# EAGLE design openSipPuff (EAGLE 9.1.3)
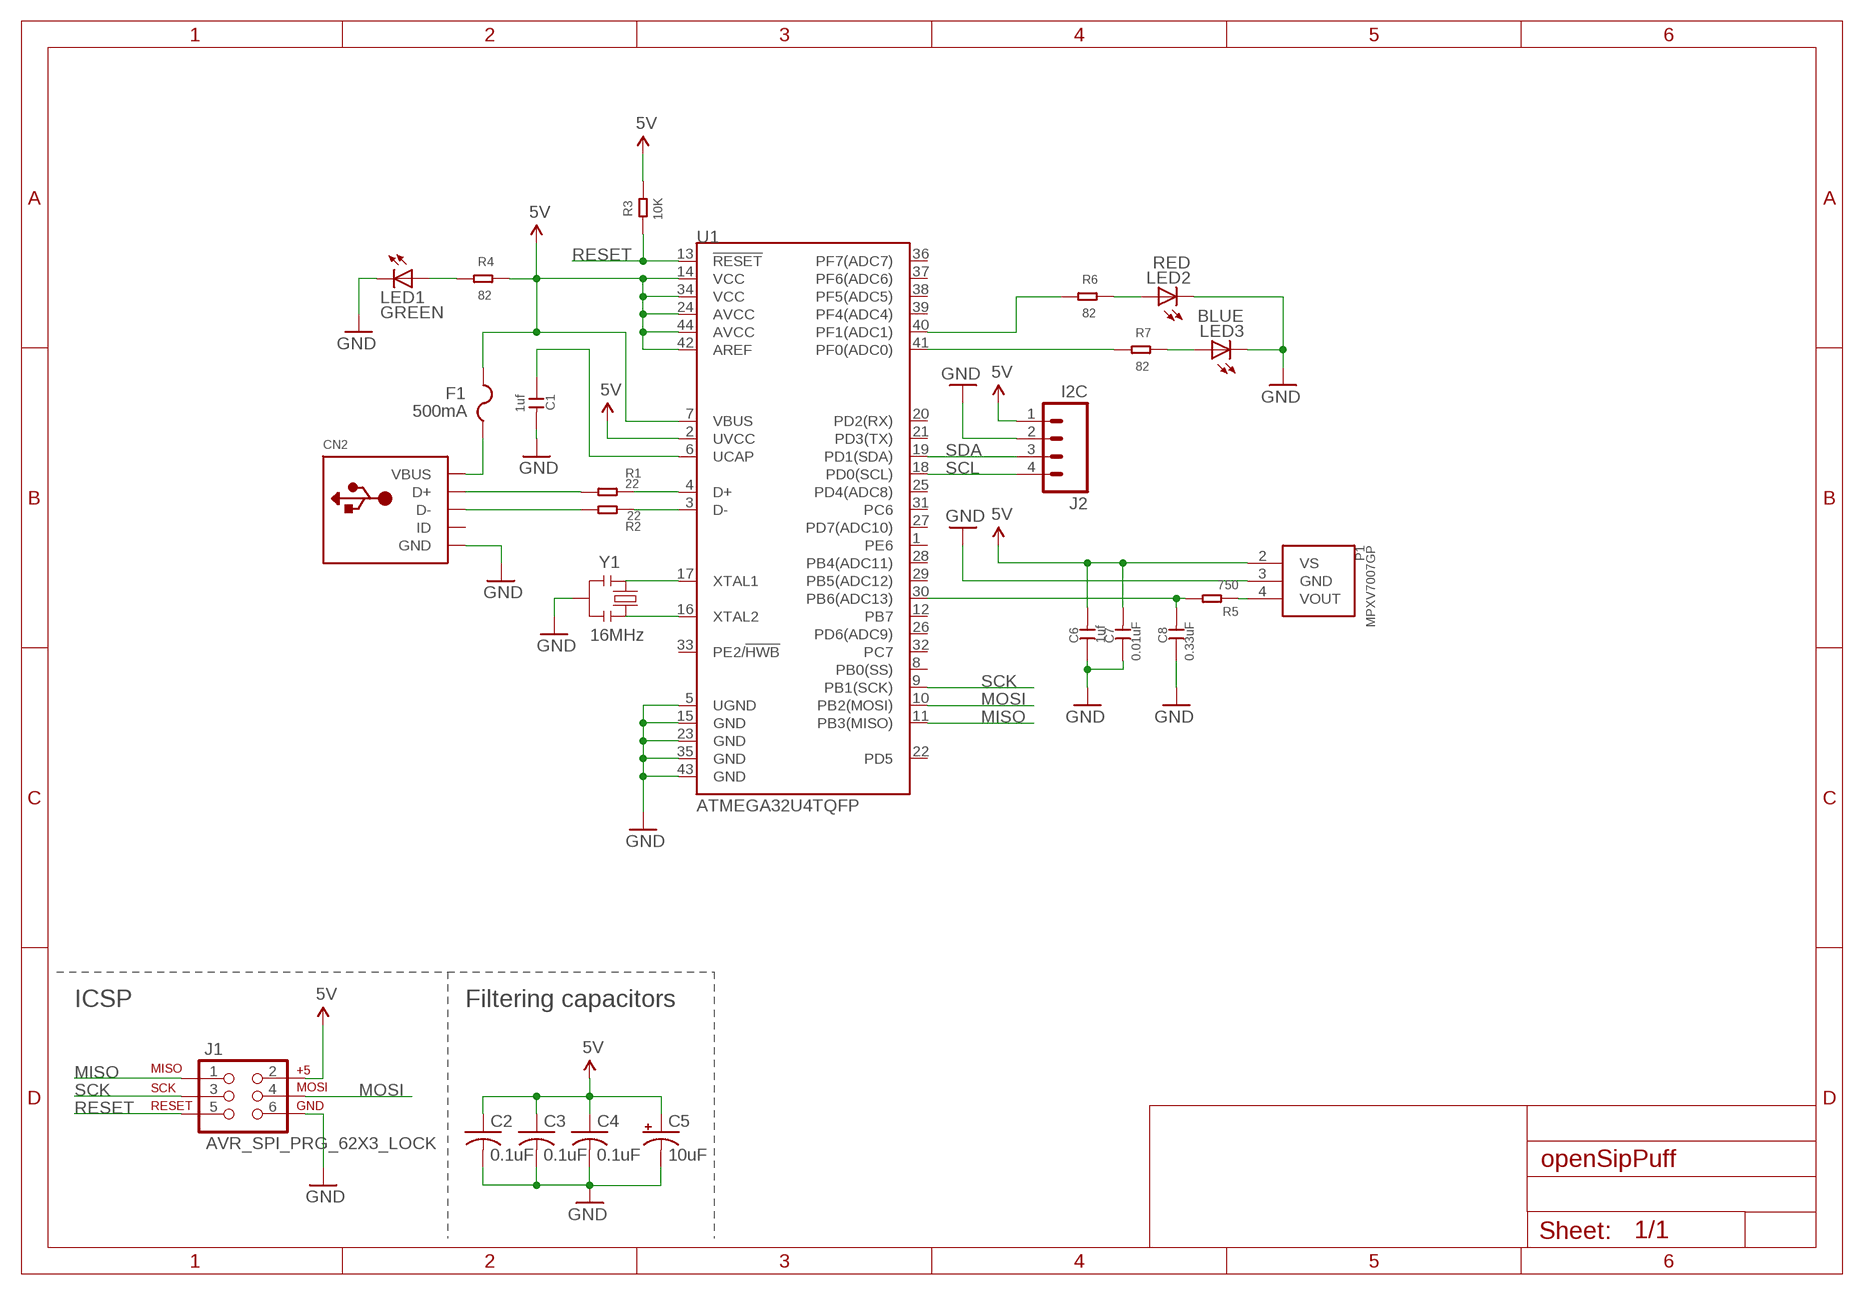
[diagram p0: schematic, sheet 1]

## Parts
C1  1uf  CERAMIC-1UF-25V-10%-X7R(0805)  [C0805]
C2  0.1uF  C-USC0805K  [C0805K]
C3  0.1uF  C-USC0805K  [C0805K]
C4  0.1uF  C-USC0805K  [C0805K]
C5  10uF  CPOL-USA/3216-18R  [A/3216-18R]
C6  1uf  CERAMIC-1UF-25V-10%-X7R(0805)  [C0805]
C7  0.01uF  CERAMIC-10NF-50V-5%-X7R(0805)  [C0805]
C8  0.33uF  CERAMIC-10NF-50V-5%-X7R(0805)  [C0805]
CN2  USBMINIB  [USB-MINIB]
F1  500mA  PTCFUSE-1206  [R1206]
J1  AVR_SPI_PRG_62X3_LOCK  [2X3_LOCK]
J2  I2C  M04PTH  [1X04]
LED1  GREEN  LEDCHIPLED_0805  [CHIPLED_0805]
LED2  RED  LEDCHIPLED_0805  [CHIPLED_0805]
LED3  BLUE  LEDCHIPLED_0805  [CHIPLED_0805]
P1  MPXV7007GP  [SOP8]
R1  22  RES-0805  [R0805]
R2  22  RES-0805  [R0805]
R3  10K  SMD-RES-10K-1%-1/8W(0805)  [R0805]
R4  82  SMD-RES-0.1R-5%-1/8W(0805)  [R0805]
R5  750  SMD-RES-2.2K-5%-1/8W(0805)  [R0805]
R6  82  SMD-RES-2.2K-5%-1/8W(0805)  [R0805]
R7  82  SMD-RES-2.2K-5%-1/8W(0805)  [R0805]
U1  ATMEGA32U4TQFP  [SPARKFUN-DIGITALIC_TQFP44]
Y1  16MHz  RESONATOR16MHZ  [RESONATOR-SMD]

## Nets
5V: C2.1 C3.1 C4.1 C5.+ C6.2 C7.2 F1.2 J1.2 J2.1 P1.2(VS) R3.2 R4.2 U1.2(UVCC) U1.7(VBUS) U1.14(VCC) U1.24(AVCC) U1.34(VCC) U1.42(AREF) U1.44(AVCC)
D+: CN2.D+ R1.1
D-: CN2.D- R2.1
GND: C1.2 C2.2 C3.2 C4.2 C5.- C6.1 C7.1 C8.1 CN2.GND J1.6 J2.2 LED1.C LED2.C LED3.C P1.3(GND) U1.5(UGND) U1.15(GND) U1.23(GND) U1.35(GND) U1.43(GND) Y1.2
MISO: J1.1 U1.11(PB3(MISO))
MOSI: J1.4 U1.10(PB2(MOSI))
N$1: R1.2 U1.4(D+)
N$2: R2.2 U1.3(D-)
N$3: C1.1 U1.6(UCAP)
N$4: CN2.VBUS F1.1
N$5: U1.17(XTAL1) Y1.1
N$6: U1.16(XTAL2) Y1.3
N$7: C8.2 R5.2 U1.30(PB6(ADC13))
N$8: R6.1 U1.40(PF1(ADC1))
N$9: R7.1 U1.41(PF0(ADC0))
N$10: P1.4(VOUT) R5.1
N$12: LED1.A R4.1
N$14: LED3.A R7.2
N$15: LED2.A R6.2
RESET: J1.5 R3.1 U1.13(!RESET)
SCK: J1.3 U1.9(PB1(SCK))
SCL: J2.4 U1.18(PD0(SCL))
SDA: J2.3 U1.19(PD1(SDA))
Unconnected: CN2.ID U1.1(PE6) U1.8(PB0(SS)) U1.12(PB7) U1.20(PD2(RX)) U1.21(PD3(TX)) U1.22(PD5) U1.25(PD4(ADC8)) U1.26(PD6(ADC9)) U1.27(PD7(ADC10)) U1.28(PB4(ADC11)) U1.29(PB5(ADC12)) U1.31(PC6) U1.32(PC7) U1.33(PE2/!HWB) U1.36(PF7(ADC7)) U1.37(PF6(ADC6)) U1.38(PF5(ADC5)) U1.39(PF4(ADC4))

## Notes on the sheet
- ICSP | Filtering capacitors

## Library data of the parts
C1 C6 = Seeed-Capacitor:CERAMIC-1UF-25V-10%-X7R(0805): 302010179; MPN: CC0805KKX7R8BB105
C2-C4 = adafruit:C-US: CAPACITOR, American symbol
C5 = adafruit:CPOL-US: POLARIZED CAPACITOR, American symbol
C7 C8 = Seeed-Capacitor:CERAMIC-10NF-50V-5%-X7R(0805): 302010175; MPN: CC0805JRX7R9BB103; VALUE: 10nf
CN2 = adafruit:USB: USB Connectors USBMINIB - Surface Mount Female Mini-B USB Connector 4UConnector: 06564 By microbuilder.eu Thru-hole RA Female Mini-B USB Connector 4UConnector: 18732 By ladyada.net
F1 = adafruit:PTCFUSE: PTC fuses, resettable thermistors
J1 = SparkFun-Connectors:AVR_SPI_PRG_6: AVR ISP 6 Pin This is the reduced ISP connector for AVR programming. Common on Arduino. This footprint will take up less PCB space and can be used with a 10-pin to 6-pin adapter such as SKU: BOB-08508
J2 = SparkFun-Connectors:M04: Header 4 Standard 4-pin 0.1" header. Use with straight break away headers (SKU : PRT-00116), right angle break away headers (PRT-00553), swiss pins (PRT-00743), machine pins (PRT-00117), and female headers (PRT-00115). Molex polarized connector foot print use with SKU : PRT-08231 with associated crimp pins and housings. 1MM SMD Version SKU: PRT-10208
LED1-LED3 = led:LED: LED OSRAM: - CHIPLED LG R971, LG N971, LY N971, LG Q971, LY Q971, LO R971, LY R971 LH N974, LH R974 LS Q976, LO Q976, LY Q976 LO Q996 - Hyper CHIPLED LW Q18S LB Q993, LB Q99A, LB R99A - SideLED LS A670, LO A670, LY A670, LG A670, LP A670 LB A673, LV A673, LT A673, LW A673 LH A674 LY A675 LS A676, LA A676, LO A676, LY A676, LW A676 LS A679, LY A679, LG A679 - Hyper Micro SIDELED® LS Y876, LA Y876, LO Y876, LY Y876 LT Y87S - SmartLED LW L88C, LW L88S LB L89C, LB L89S, LG L890 LS L89K, LO L89K, LY L89K LS L896, LA L896, LO L896, LY L896 - TOPLED LS T670, LO T670, LY T670, LG T670, LP T670 LSG T670, LSP T670, LSY T670, LOP T670, LYG T670 LG T671, LOG T671, LSG T671 LB T673, LV T673, LT T673, LW T673 LH T674 LS T676, LA T676, LO T676, LY T676, LB T676, LH T676, LSB T676, LW T676 LB T67C, LV T67C, LT T67C, LS T67K, LO T67K, LY T67K, LW E67C LS E67B, LA E67B, LO E67B, LY E67B, LB E67C, LV E67C, LT E67C LW T67C LS T679, LY T679, LG T679 LS T770, LO T770, LY T770, LG T770, LP T770 LB T773, LV T773, LT T773, LW T773 LH T774 LS E675, LA E675, LY E675, LS T675 LS T776, LA T776, LO T776, LY T776, LB T776 LHGB T686 LT T68C, LB T68C - Hyper Mini TOPLED® LB M676 - Mini TOPLED Santana® LG M470 LS M47K, LO M47K, LY M47K Source: http://www.osram.convergy.de LUXEON: - LUMILED® LXK2-PW12-R00, LXK2-PW12-S00, LXK2-PW14-U00, LXK2-PW14-V00 LXK2-PM12-R00, LXK2-PM12-S00, LXK2-PM14-U00 LXK2-PE12-Q00, LXK2-PE12-R00, LXK2-PE12-S00, LXK2-PE14-T00, LXK2-PE14-U00 LXK2-PB12-K00, LXK2-PB12-L00, LXK2-PB12-M00, LXK2-PB14-N00, LXK2-PB14-P00, LXK2-PB14-Q00 LXK2-PR12-L00, LXK2-PR12-M00, LXK2-PR14-Q00, LXK2-PR14-R00 LXK2-PD12-Q00, LXK2-PD12-R00, LXK2-PD12-S00 LXK2-PH12-R00, LXK2-PH12-S00 LXK2-PL12-P00, LXK2-PL12-Q00, LXK2-PL12-R00 Source: www.luxeon.com KINGBRIGHT: KA-3528ASYC Source: www.kingbright.com
P1 = MPXV7007GP:MPXV7007GP: MPXV7007GP <https://www.digikey.com/product-detail/en/freescale-semiconductor-nxp/MPXV7007GP/MPXV7007GP-ND/1168441> - analog pressure sensor (side port) Manufacturer: NXP USA Inc. Series: MPXV7007 Operating pressure: ±1.02 PSI (±7 kPa) Output type: Analog Voltage Output: 0.5 V ~ 4.5 V Voltage supply: 4.75 V ~ 5.25 V Supplier device package: 8-SOP Supporting materials: MPXV7007GP datasheet <http://cache.freescale.com/files/sensors/doc/data_sheet/MPXV7007.pdf>
R1 R2 = Seeed-OPL-Resistor:RES
R3 = Seeed-Resistor:SMD-RES-10K-1%-1/8W(0805): 301010361; MPN: RC0805FR-0710KL
R4 = Seeed-Resistor:SMD-RES-0.1R-5%-1/8W(0805): 301010264; MPN: RL0805JR-070R1L; VALUE: 0.1R
R5-R7 = Seeed-Resistor:SMD-RES-2.2K-5%-1/8W(0805): 301010333; MPN: RC0805JR-072K2L; VALUE: 2.2K
U1 = SparkFun-DigitalIC:ATMEGA32U4: Atmel 44-pin 8-bit Microcontroller with 32KBytes of ISP Flash and USB Controller
Y1 = SparkFun-FreqCtrl:RESONATOR: Resonator Small SMD resonator. Used, eg, on the Arduino Pro/ Pro Mini boards. 8MHz- XTAL-08895 16MHz- XTAL-08900; PROD_ID: XTAL-08900

## Board
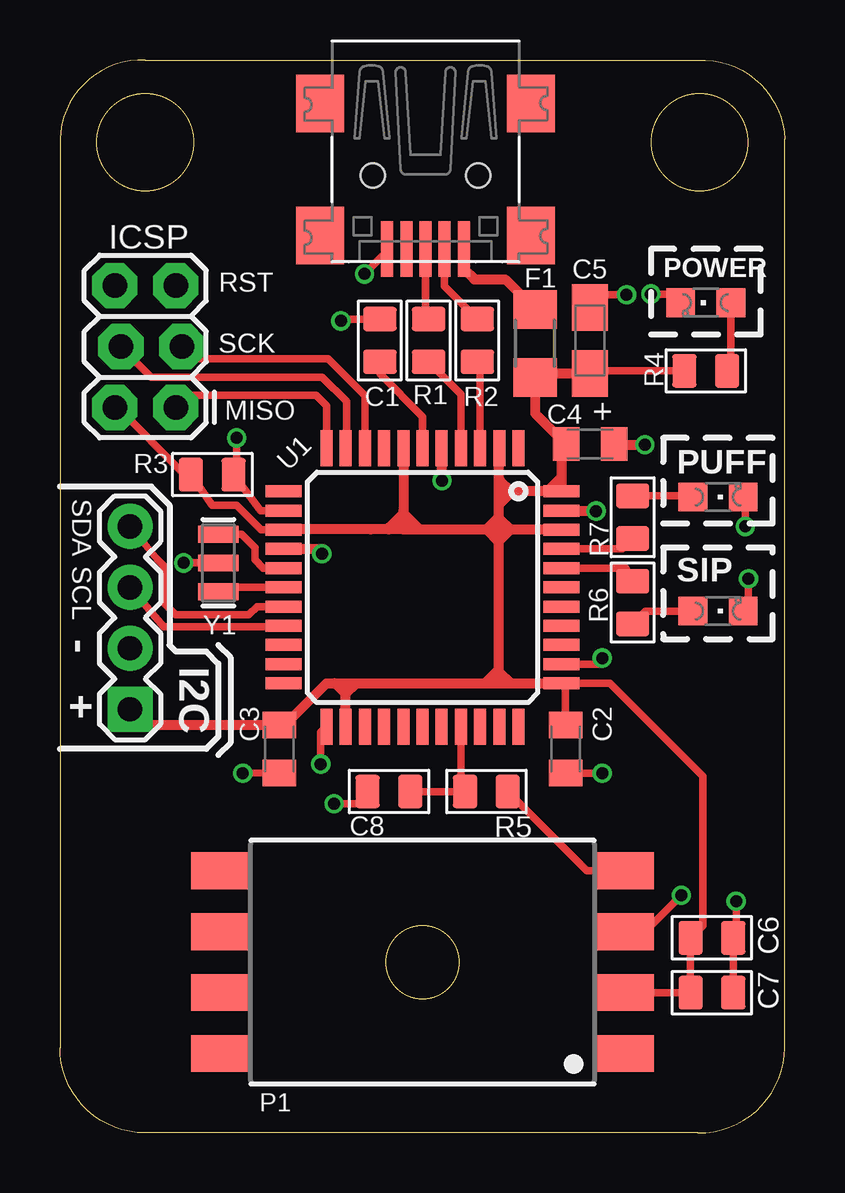
[diagram p1: board, top side]
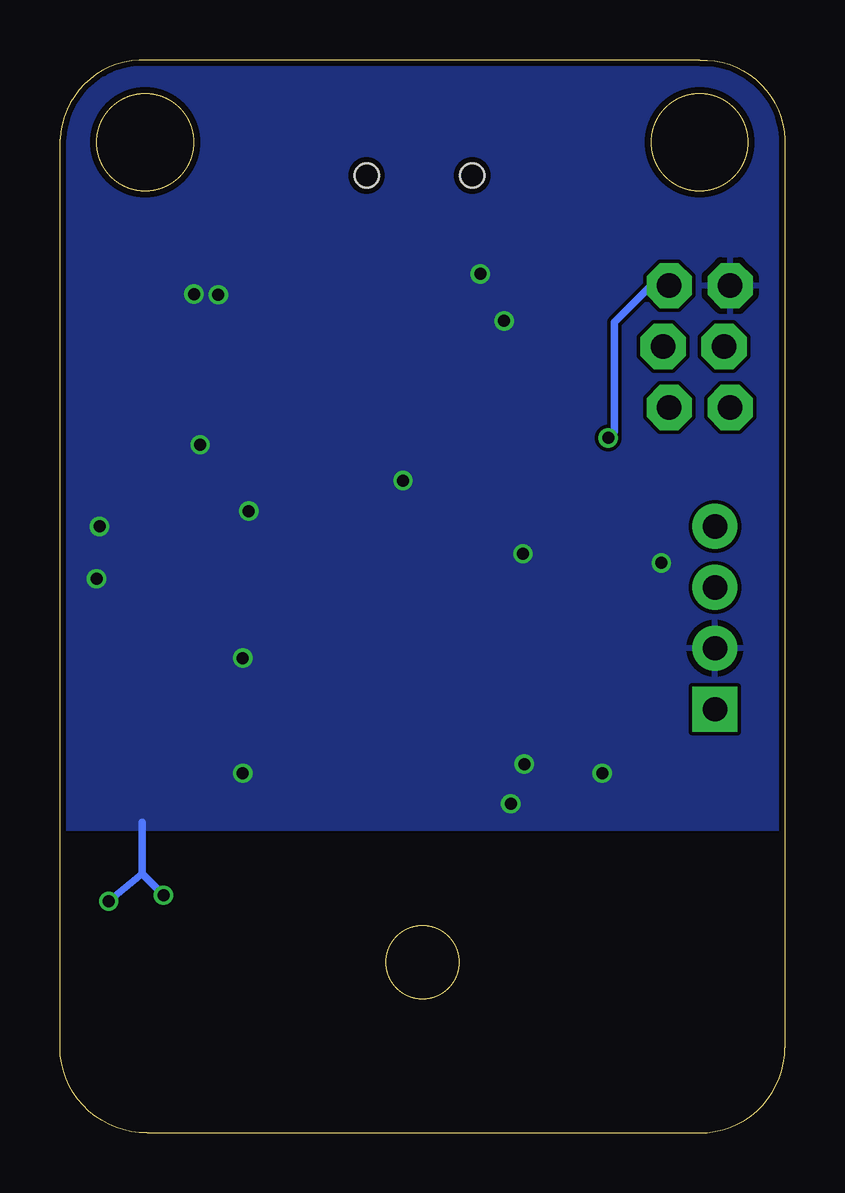
[diagram p2: board, bottom side, seen from below]

Size 30.23 x 44.7 mm. Coordinates in mm from the lower left corner, seen from the top.
Outline: 30.23,3.56 30.23,41.4 arc90 26.59,44.7 3.56,44.7 arc90 0,41.4 0,3.56 arc90 3.56,0 26.59,0 arc90 30.23,3.56
Outline: circle at 3.56,41.27 radius 2.02
Outline: circle at 26.67,41.27 radius 2.02
Copper layers (1*16): Top 0.035mm / dielectric 1.5mm / Bottom 0.035mm
Design rules "SeeedStudio_2layer_DRU_no_angle_20140221": minimum track width 6mil, minimum drill 12mil, track to track 6mil, track to pad 6mil, pad to pad 6mil, via to via 6mil, smd to smd 0mil, copper to edge 10mil, drill to drill 10mil, minimum pad ring 10mil, minimum via ring 6mil, stop-mask expansion 2mil, vias tented up to drill 100mil, thermal gap 10mil

### Footprints (pad centres in the part's own frame; a part is rotated, then mirrored left to right if it is on the bottom)
C0805 = smd 1.397 x 1.016: 1 0,0.889; 2 0,-0.889
C0805K = smd 1.1 x 1.4: 1 -1,0; 2 1,0
A/3216-18R = smd 1.95 x 1.5: + 1.375,0; - -1.375,0
USB-MINIB = smd 0.5 x 2.308: D+ 0,4.064; D- -0.8,4.064; GND 1.6,4.064; ID 0.8,4.064; VBUS -1.6,4.064 | smd 2 x 2.4: GND1 -4.4,-2; GND2 -4.4,3.5; GND3 4.4,3.5; GND4 4.4,-2 | hole 1: -2.2,1; 2.2,1
R1206 = smd 1.6 x 1.803: 1 -1.422,0; 2 1.422,0
2X3_LOCK = drill 1.016 pad 1.88 octagon: 1 0,0; 2 0,2.54; 3 2.54,-0.254; 4 2.54,2.286; 5 5.08,0; 6 5.08,2.54
1X04 = drill 1.016 pad 1.88 square: 1 0,0 | drill 1.016 pad 1.88: 2 2.54,0; 3 5.08,0; 4 7.62,0
CHIPLED_0805 = smd 1.2 x 1.2: A 0,-1.05; C 0,1.05
SOP8 = smd 1.524 x 2.54: 1 -3.81,-8.382; 2 -1.27,-8.382; 3 1.27,-8.382; 4 3.81,-8.382; 5 3.81,8.382; 6 1.27,8.382; 7 -1.27,8.382; 8 -3.81,8.382
R0805 = smd 1.397 x 1.016: 1 0,0.889; 2 0,-0.889
SPARKFUN-DIGITALIC_TQFP44 = smd 1.5 x 0.5: 1 -5.8,4; 2 -5.8,3.2; 3 -5.8,2.4; 4 -5.8,1.6; 5 -5.8,0.8; 6 -5.8,0; 7 -5.8,-0.8; 8 -5.8,-1.6; 9 -5.8,-2.4; 10 -5.8,-3.2; 11 -5.8,-4; 23 5.8,-4; 24 5.8,-3.2; 25 5.8,-2.4; 26 5.8,-1.6; 27 5.8,-0.8; 28 5.8,0; 29 5.8,0.8; 30 5.8,1.6; 31 5.8,2.4; 32 5.8,3.2; 33 5.8,4 | smd 0.5 x 1.5: 12 -4,-5.8; 13 -3.2,-5.8; 14 -2.4,-5.8; 15 -1.6,-5.8; 16 -0.8,-5.8; 17 0,-5.8; 18 0.8,-5.8; 19 1.6,-5.8; 20 2.4,-5.8; 21 3.2,-5.8; 22 4,-5.8; 34 4,5.8; 35 3.2,5.8; 36 2.4,5.8; 37 1.6,5.8; 38 0.8,5.8; 39 0,5.8; 40 -0.8,5.8; 41 -1.6,5.8; 42 -2.4,5.8; 43 -3.2,5.8; 44 -4,5.8
RESONATOR-SMD = smd 0.7 x 1.7: 1 -1.2,0; 2 0,0; 3 1.2,0

### Placement (x,y rotation side)
C1  13.34,33.02 180 top
C2  21.08,16 270 top
C3  9.14,16 270 top
C4  22.1,28.7 0 top
C5  22.1,33.02 270 top
C6  27.18,8.13 270 top
C7  27.18,5.84 270 top
C8  13.72,14.22 90 top
CN2  15.24,40.89 180 top
F1  19.81,32.89 270 top
J1  4.83,30.23 90 top
J2  2.92,17.65 90 top
LED1  26.92,34.59 90 top
LED2  27.43,21.74 270 top
LED3  27.43,26.49 270 top
P1  15.11,7.11 90 top
R1  15.37,33.02 0 top
R2  17.4,33.02 0 top
R3  6.35,27.43 270 top
R4  26.92,31.75 270 top
R5  17.78,14.22 270 top
R6  23.88,22.1 0 top
R7  23.88,25.65 180 top
U1  15.11,22.73 270 top
Y1  6.6,23.75 90 top

### Tracks (layer width: path | path; a pad name or v marks a point on that pad's centre or on a via)
5V
  Top 0.305: U1.14 8.39,25.13 7.37,26.16 6.35,26.16 R3.2 5.21,27.43 2.41,30.23 J1.2 | C2.1 21.08,18.56 U1.34 22.92,18.73 26.8,14.86 26.8,8.64 C6.2 C7.2 P1.2 | R4.2 22.2,31.75 C5.+
  Top 0.406: U1.2 18.29,28.53 18.29,27.18 | 18.29,27.18 18.29,26.67 | 18.29,26.67 18.29,26.16 | 18.29,26.16 18.29,25.65 | 18.29,25.64 18.29,25.4 18.29,25.15 | 18.29,25.13 18.29,24.64 | 18.29,24.64 18.29,19.3 | 18.29,19.24 18.29,18.73 | 18.29,18.73 18.8,18.73 | 18.8,18.73 U1.34 | 11.47,18.73 11.94,18.73 | 11.94,18.73 12.36,18.73 | 17.78,18.73 12.45,18.73 12.36,18.73 | 17.78,18.73 18.29,18.73 | U1.14 9.31,25.15 12.95,25.15 13.72,25.15 | 14.31,25.15 13.72,25.15 | U1.7 14.31,25.91 14.31,25.82 | 14.31,25.82 14.31,25.15 | U1.42 18.8,25.13 | 18.78,25.13 18.29,25.13 | 20.32,26.73 U1.44 20.91,27.33 | 20.32,26.73 19.05,26.73 18.86,26.73 | 18.86,26.73 18.8,26.73 | 18.8,26.73 18.35,26.73 18.29,26.67 | C5.+ 19.99,31.64 F1.2 19.81,29.99 C4.1 20.91,28.52 20.91,27.43 20.91,27.33 | U1.24 11.91,18.29 | 11.91,18.29 11.91,18.71 11.94,18.73 | J2.1 3.32,17 C3.1 9.38,17 11.11,18.73 11.43,18.73 11.47,18.73 | 18.29,25.15 18.29,25.13 | 14.31,25.15 14.99,25.15 | 14.99,25.15 17.78,25.15 | 17.78,25.15 18.29,25.15 | 18.86,26.73 18.29,26.16 | 17.78,25.15 18.29,25.65 | 18.29,25.65 18.29,25.64 | 18.29,25.64 18.8,25.13 | 17.78,25.15 18.29,24.64 | 18.29,24.64 18.78,25.13 | 18.78,25.13 18.8,25.13 | 18.8,26.73 18.35,27.18 18.29,27.18 | 14.99,25.15 14.31,25.82 | 13.72,25.15 13.72,25.22 14.31,25.82 | 17.78,18.73 17.78,18.8 18.29,19.3 | 18.29,19.3 18.29,19.24 | 18.29,19.24 18.8,18.73 | 11.91,18.29 11.47,18.73 | 11.91,18.29 12.36,18.73 | 20.91,27.33 20.32,26.73
D+
  Top 0.305: CN2.D+ 15.24,33.79 R1.1
D-
  Top 0.305: R2.1 16.04,35.27 CN2.D-
GND  (via drill 0.5)
  Top 0.305: U1.35 22.61,19.53 v22.61,19.79 | C3.2 v7.62,14.99 | Y1.2 v5.16,23.75 | v10.87,15.37 10.87,16.69 U1.23 | C2.2 21.1,14.99 v22.61,14.99 | C8.1 arc-90 12.32,13.72 v11.43,13.72 | v28.19,9.65 28.19,8.26 arc-90 C6.1 C7.1 | v12.7,35.79 13.64,36.73 CN2.GND | C1.2 11.79,33.91 v11.71,33.83 | P1.3 24.38,8.38 v25.91,9.91 | v28.7,23.09 28.7,21.96 LED2.C | v28.57,25.27 28.57,26.4 LED3.C | LED1.C 25.52,34.95 v24.64,34.95 | C5.- 22.63,34.92 v23.62,34.92
  Top 0.406: U1.5 15.91,27.19 v15.93,27.18 | U1.15 10.97,24.33 v10.92,24.13 | U1.43 22.1,25.93 v22.35,25.91 | C4.2 23.12,28.68 v24.38,28.68
  Bottom 0.305: v25.91,9.91 26.8,10.79 | 26.8,10.79 26.8,12.95 | v28.19,9.65 26.8,10.79
  pour Bottom: -0.25,12.7 30.48,12.7 30.48,45.09 -0.25,45.09
MISO
  Top 0.305: J1.1 5.33,30.73 10.67,30.73 11.11,30.29 U1.11
MOSI
  Top 0.305: J1.4 3.81,31.5 10.92,31.5 11.94,30.48 11.94,28.56 U1.10
N$1
  Top 0.305: R1.2 16.71,30.79 U1.4
N$2
  Top 0.305: U1.3 17.51,32.02 R2.2
N$3
  Top 0.305: C1.1 13.34,31.62 15.11,29.84 U1.6
N$4
  Top 0.406: CN2.VBUS 16.84,35.99 17.27,35.56 18.57,35.56 F1.1
N$5
  Top 0.305: Y1.1 6.79,22.73 U1.17
N$6
  Top 0.305: Y1.3 7.56,24.95 8.13,24.38 8.13,23.88 8.47,23.53 U1.16
N$7
  Top 0.305: U1.30 16.71,14.4 arc90 R5.2 C8.2
N$8
  Top 0.305: U1.40 23.59,23.53 R6.1
N$9
  Top 0.305: U1.41 23.45,24.33 R7.1
N$10
  Top 0.305: P1.4 21.97,10.92 R5.1
N$12
  Top 0.305: R4.1 27.97,31.91 LED1.A
N$14
  Top 0.305: R7.2 26.38,26.55 LED3.A
N$15
  Top 0.305: R6.2 24.41,21.74 LED2.A
RESET  (via drill 0.5)
  Top 0.305: U1.13 8.36,25.93 R3.1 arc90 7.37,27.56 v7.37,28.96
  Bottom 0.305: J1.5 5.59,35.31 7.11,33.78 7.11,29.21 v7.37,28.96
SCK
  Top 0.305: J1.3 5.59,32.26 11.18,32.26 12.71,30.72 U1.9
SCL
  Top 0.305: J2.4 4.06,23.88 4.32,23.62 4.32,22.1 4.83,21.59 7.87,21.59 8.22,21.93 U1.18
SDA
  Top 0.305: J2.3 4.32,21.08 9.26,21.08 U1.19

### Text on the board
tPlace: ICSP | POWER | RST | SCK | MISO | PUFF | SDA | SCL | SIP | - | + | I2C